# Altium schematic sheet yard-ice-ethernet.SchDoc: Yard-Ice-Ethernet
size 365 x 274 mm; Revision: 1.0; SheetNumber: 5; SheetTotal: 5
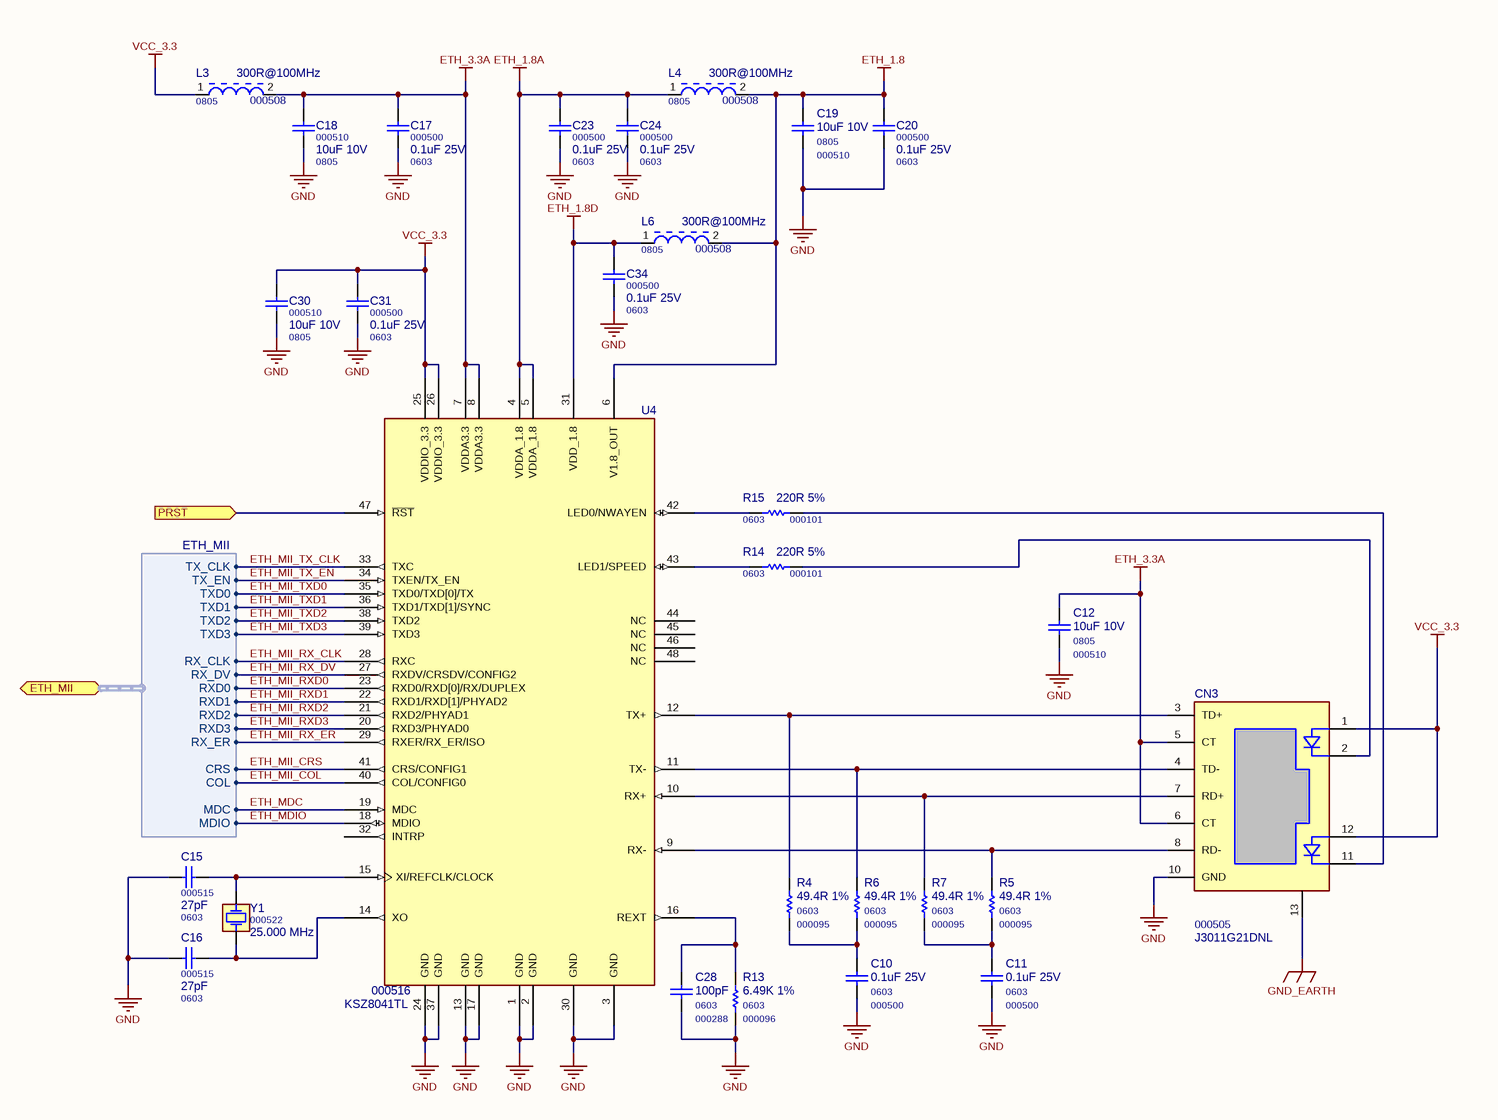
[diagram p0: yard-ice-ethernet.SchDoc]

## Parts
C10  000500  value 0.1uF 25V  Package: 0603  [C0603M]
C11  000500  value 0.1uF 25V  Package: 0603  [C0603M]
C12  000510  value 10uF 10V  Package: 0805  [C0805M]
C15  000515  value 27pF  Package: 0603  [C0603M]
C16  000515  value 27pF  Package: 0603  [C0603M]
C17  000500  value 0.1uF 25V  Package: 0603  [C0603M]
C18  000510  value 10uF 10V  Package: 0805  [C0805M]
C19  000510  value 10uF 10V  Package: 0805  [C0805M]
C20  000500  value 0.1uF 25V  Package: 0603  [C0603M]
C23  000500  value 0.1uF 25V  Package: 0603  [C0603M]
C24  000500  value 0.1uF 25V  Package: 0603  [C0603M]
C28  000288  value 100pF  Package: 0603  [C0603M]
C30  000510  value 10uF 10V  Package: 0805  [C0805M]
C31  000500  value 0.1uF 25V  Package: 0603  [C0603M]
C34  000500  value 0.1uF 25V  Package: 0603  [C0603M]
CN3  000505  value J3011G21DNL  [MOD-J3]
L3  000508  value 300R@100MHz  Package: 0805  [L0805M]
L4  000508  value 300R@100MHz  Package: 0805  [L0805M]
L6  000508  value 300R@100MHz  Package: 0805  [L0805M]
R4  000095  value 49.4R 1%  Package: 0603  [R0603M]
R5  000095  value 49.4R 1%  Package: 0603  [R0603M]
R6  000095  value 49.4R 1%  Package: 0603  [R0603M]
R7  000095  value 49.4R 1%  Package: 0603  [R0603M]
R13  000096  value 6.49K 1%  Package: 0603  [R0603M]
R14  000101  value 220R 5%  Package: 0603  [R0603M]
R15  000101  value 220R 5%  Package: 0603  [R0603M]
U4  000516  value KSZ8041TL  [48-TQFP]
Y1  000522  value 25.000 MHz  [ABM3-H]

## Ports
ETH_MII (harness ETH_MII), PRST (in)

## Harnesses
ETH_MII: TX_CLK, TX_EN, TXD0, TXD1, TXD2, TXD3, RX_CLK, RX_DV, RXD0, RXD1, RXD2, RXD3, RX_ER, CRS, COL, MDC, MDIO

## Nets
ETH_1.8: C19.1 C20.1 L4.2 L6.2 U4.6(V1.8_OUT)
ETH_1.8A: C23.1 C24.1 L4.1 U4.4(VDDA_1.8) U4.5(VDDA_1.8)
ETH_1.8D: C34.1 L6.1 U4.31(VDD_1.8)
ETH_3.3A: C12.1 C17.1 C18.1 CN3.5(CT) CN3.6(CT) L3.2 U4.7(VDDA3.3) U4.8(VDDA3.3)
GND: C10.2 C11.2 C12.2 C15.1 C16.1 C17.2 C18.2 C19.2 C20.2 C23.2 C24.2 C28.2 C30.2 C31.2 C34.2 CN3.10(GND) R13.1 U4.1(GND) U4.2(GND) U4.3(GND) U4.13(GND) U4.17(GND) U4.24(GND) U4.30(GND) U4.37(GND)
GND_EARTH: CN3.13(SHIELD)
VCC_3.3: C30.1 C31.1 CN3.1(A2) CN3.12(A1) L3.1 U4.25(VDDIO_3.3) U4.26(VDDIO_3.3)
ETH_MDC: U4.19(MDC) ; port ETH_MII.MDC
ETH_MDIO: U4.18(MDIO) ; port ETH_MII.MDIO
ETH_MII_COL: U4.40(COL/CONFIG0) ; port ETH_MII.COL
ETH_MII_CRS: U4.41(CRS/CONFIG1) ; port ETH_MII.CRS
ETH_MII_RX_CLK: U4.28(RXC) ; port ETH_MII.RX_CLK
ETH_MII_RX_DV: U4.27(RXDV/CRSDV/CONFIG2) ; port ETH_MII.RX_DV
ETH_MII_RX_ER: U4.29(RXER/RX_ER/ISO) ; port ETH_MII.RX_ER
ETH_MII_RXD0: U4.23(RXD0/RXD[0]/RX/DUPLEX) ; port ETH_MII.RXD0
ETH_MII_RXD1: U4.22(RXD1/RXD[1]/PHYAD2) ; port ETH_MII.RXD1
ETH_MII_RXD2: U4.21(RXD2/PHYAD1) ; port ETH_MII.RXD2
ETH_MII_RXD3: U4.20(RXD3/PHYAD0) ; port ETH_MII.RXD3
ETH_MII_TX_CLK: U4.33(TXC) ; port ETH_MII.TX_CLK
ETH_MII_TX_EN: U4.34(TXEN/TX_EN) ; port ETH_MII.TX_EN
ETH_MII_TXD0: U4.35(TXD0/TXD[0]/TX) ; port ETH_MII.TXD0
ETH_MII_TXD1: U4.36(TXD1/TXD[1]/SYNC) ; port ETH_MII.TXD1
ETH_MII_TXD2: U4.38(TXD2) ; port ETH_MII.TXD2
ETH_MII_TXD3: U4.39(TXD3) ; port ETH_MII.TXD3
PRST: U4.47(~{RST}) ; port PRST
NetC10_1: C10.1 R4.1 R6.1
NetC11_1: C11.1 R5.1 R7.1
NetC15_2: C15.2 U4.15(XI/REFCLK/CLOCK) Y1.1
NetC16_2: C16.2 U4.14(XO) Y1.2
NetC28_1: C28.1 R13.2 U4.16(REXT)
NetCN3_2: CN3.2(K2) R14.1
NetCN3_3: CN3.3(TD+) R4.2 U4.12(TX+)
NetCN3_4: CN3.4(TD-) R6.2 U4.11(TX-)
NetCN3_7: CN3.7(RD+) R7.2 U4.10(RX+)
NetCN3_8: CN3.8(RD-) R5.2 U4.9(RX-)
NetCN3_11: CN3.11(K1) R15.1
NetR14_2: R14.2 U4.43(LED1/SPEED)
NetR15_2: R15.2 U4.42(LED0/NWAYEN)

Not connected (* = marked no-connect by the designer): U4 32(INTRP) 44(NC) 45(NC) 46(NC) 48(NC)

## Notes on the sheet
- TITLE
- CHK
- DWN
- APV
- DWG
- REV
- File:
- Sheet
- of

## Library data of the parts
C10 C11 C17 C20 C23 C24 C31 C34 = C0603: SMD Ceramic Chip Capacitor - 0603 - X7R; MF PN: C1608X7R1E104K; MF: TDK; PN: 000500
C12 C18 C19 C30 = C0805: SMD Ceramic Chip Capacitor - 0805 - X7R; MF PN: C2012X7R1A106K; MF: TDK; PN: 000510
C15 C16 C28 = C0603: SMD Ceramic Chip Capacitor - 0603
  C15 C16: PN: 000515
  C28: PN: 000288
CN3 = J3011G21DNL: 10/100Base-TX surface mount RJ45; MF: Pulse; Package: SMT; PN: 000505
L3 L4 L6 = L0805: SMD Ferrite Bead 0805; MF PN: MMZ2012Y301B; MF: TDK; PN: 000508
R4-R7 R13-R15 = R0603: SMD Chip Resistor - 0603
  R4-R7: PN: 000095
  R13: PN: 000096
  R14 R15: PN: 000101
U4 = KSZ8041TL: 10Base-T/100Base-TX Physical Layer Transceiver; MF: Micrel; PN: 000516; Package: 48-TQFP
Y1 = ABM3: Miniature Ceramic SMD Crystal; MF: Abracon; MF PN: ABM3-25.000MHZ-B2-T; Package: ABM3; PN: 000522